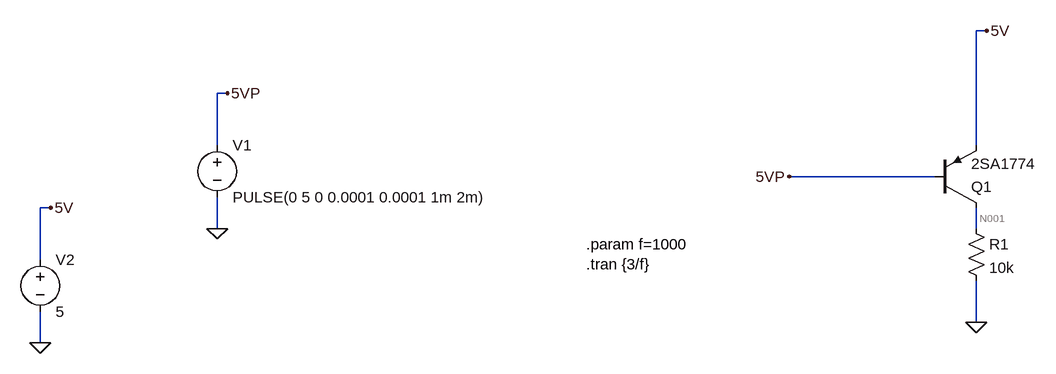
[diagram p0: schematic led_circuit.asc]
led_circuit.asc, the LTspice schematic file:
Version 4
SHEET 1 1256 680
WIRE 1136 -64 1120 -64
WIRE -32 32 -48 32
WIRE -48 112 -48 32
WIRE 1120 112 1120 -64
WIRE 1056 160 832 160
WIRE -304 208 -320 208
WIRE -48 240 -48 192
WIRE 1120 240 1120 208
WIRE -320 288 -320 208
WIRE 1120 384 1120 320
WIRE -320 416 -320 368
FLAG -32 32 5VP
FLAG -48 240 0
FLAG -304 208 5V
FLAG -320 416 0
FLAG 1136 -64 5V
FLAG 832 160 5VP
FLAG 1120 384 0
SYMBOL voltage -48 96 R0
WINDOW 123 0 0 Left 0
WINDOW 39 0 0 Left 0
SYMATTR InstName V1
SYMATTR Value PULSE(0 5 0 0.0001 0.0001 1m 2m)
SYMBOL voltage -320 272 R0
WINDOW 123 0 0 Left 0
WINDOW 39 0 0 Left 0
SYMATTR InstName V2
SYMATTR Value 5
SYMBOL pnp 1056 208 M180
SYMATTR InstName Q1
SYMATTR Value 2SA1774
SYMBOL res 1104 224 R0
SYMATTR InstName R1
SYMATTR Value 10k
TEXT 520 264 Left 2 !.param f=1000\n.tran {3/f}

The netlist it stands for:
* led_circuit.asc
V1 5VP 0 PULSE(0 5 0 0.0001 0.0001 1m 2m)
V2 5V 0 5
Q1 N001 5VP 5V 0 2SA1774
R1 N001 0 10k
.model NPN NPN
.model PNP PNP
.lib standard.bjt
.param f=1000
.tran {3/f}
.backanno
.end

* Results of the author's LTspice run, read from the files saved beside the schematic
* Operating Point, zero values left out:
*   V(5v) = 5 V
*   V(n001) = 4.865 V
*   Ic(Q1) = -486.5 µA
*   Ib(Q1) = -523.3 mA
*   Ie(Q1) = 523.8 mA
*   I(R1) = 486.5 µA
*   I(V2) = -523.8 mA
*   I(V1) = 523.3 mA
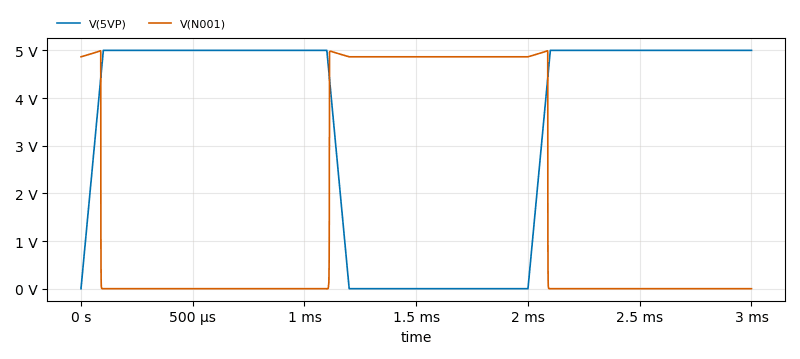
[diagram p1: Transient Analysis of led_circuit.asc, plotted from the saved traces]
* Transient Analysis, 1 run:
*   V(5VP): min 0 V, max 5 V, average 3.417 V, rms 4.087 V, last 5 V
*   V(N001): min -2.382 mV, max 4.992 V, average 1.735 V, rms 2.909 V, last 2.76 µV